# EAGLE design untitled (EAGLE 7.6.0)
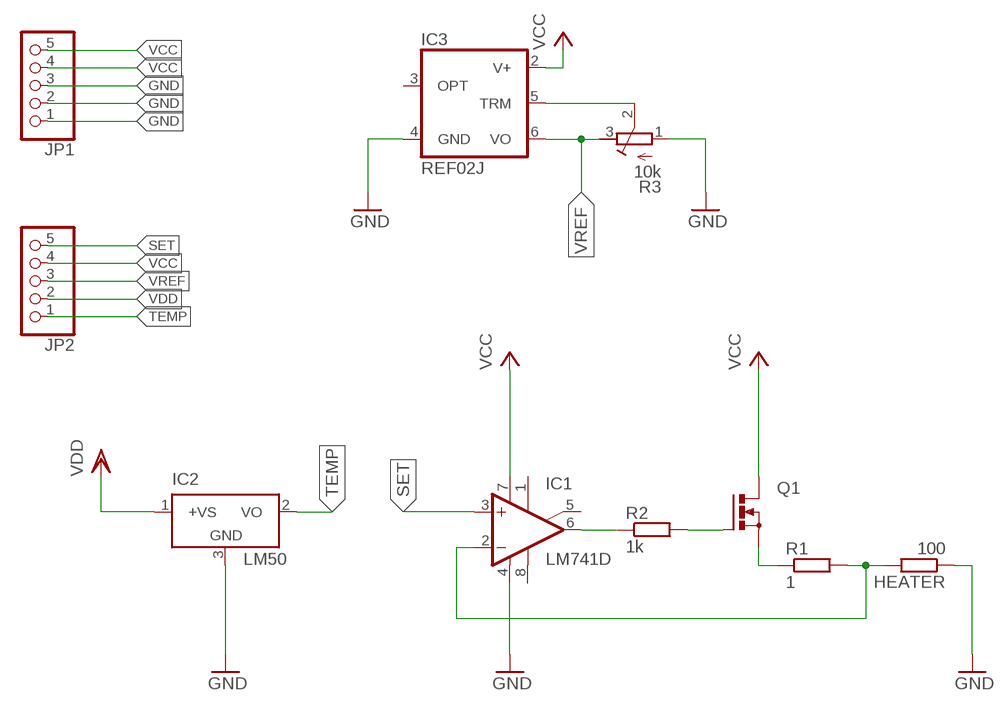
[diagram p0: schematic, sheet 1]

## Parts
HEATER  100  R-EU_WSC0001  [WSC0001]
IC1  LM741D  [SO08]
IC2  LM50  [SOT23]
IC3  REF02J  [TO99]
JP1  PINHD-1X5  [1X05]
JP2  PINHD-1X5  [1X05]
Q1  N-MOSFET-SO8S  [SO-08]
R1  1  R-EU_R1206  [R1206]
R2  1k  R-EU_R1206  [R1206]
R3  10k  R-TRIMM3103  [RTRIM3103]

## Nets
GND: HEATER.1 IC1.4(V-) IC2.3(GND) IC3.4(GND) JP1.1 JP1.2 JP1.3 R3.1(A)
N$1: IC1.6(OUT) R2.1
N$2: Q1.4(G) R2.2
N$3: HEATER.2 IC1.2(-IN) R1.2
N$4: Q1.1(S) Q1.2(S) Q1.3(S) R1.1
N$6: IC3.5(TRM) R3.2(S)
SET: IC1.3(+IN) JP2.5
TEMP: IC2.2(VO) JP2.1
VCC: IC1.7(V+) IC3.2(V+) JP1.4 JP1.5 JP2.4 Q1.5(D) Q1.6(D) Q1.7(D) Q1.8(D)
VDD: IC2.1(+VS) JP2.2
VREF: IC3.6(VO) JP2.3 R3.3(E)
Unconnected: IC1.1(ON1) IC1.5(ON2) IC1.8(OPT) IC3.3(OPT)

## Library data of the parts
HEATER R1 R2 = rcl:R-EU_: RESISTOR, European symbol
IC1 = linear:*741: OP AMP
IC2 = linear:LM50: SOT-23 Single-Supply Centigrade Temperature Sensor Vout = (10mV/°C x Temp °C) +5mmmV Source: http://cache.national.com/ds/LM/LM50.pdf
IC3 = linear:REF02: VOLTAGE REFERENCE
JP1 JP2 = pinhead:PINHD-1X5: PIN HEADER
Q1 = transistor-power:N-MOSFET-SO8: N-Channel MOSFET Example: FDS7760A; N-Channel Logic Level PowerTrench® MOSFET FDS2572; N-Channel UltraFET® Trench MOSFET Source: www.fairchildsemi.com
R3 = rcl:R-TRIMM: Trimm resistor

## Board
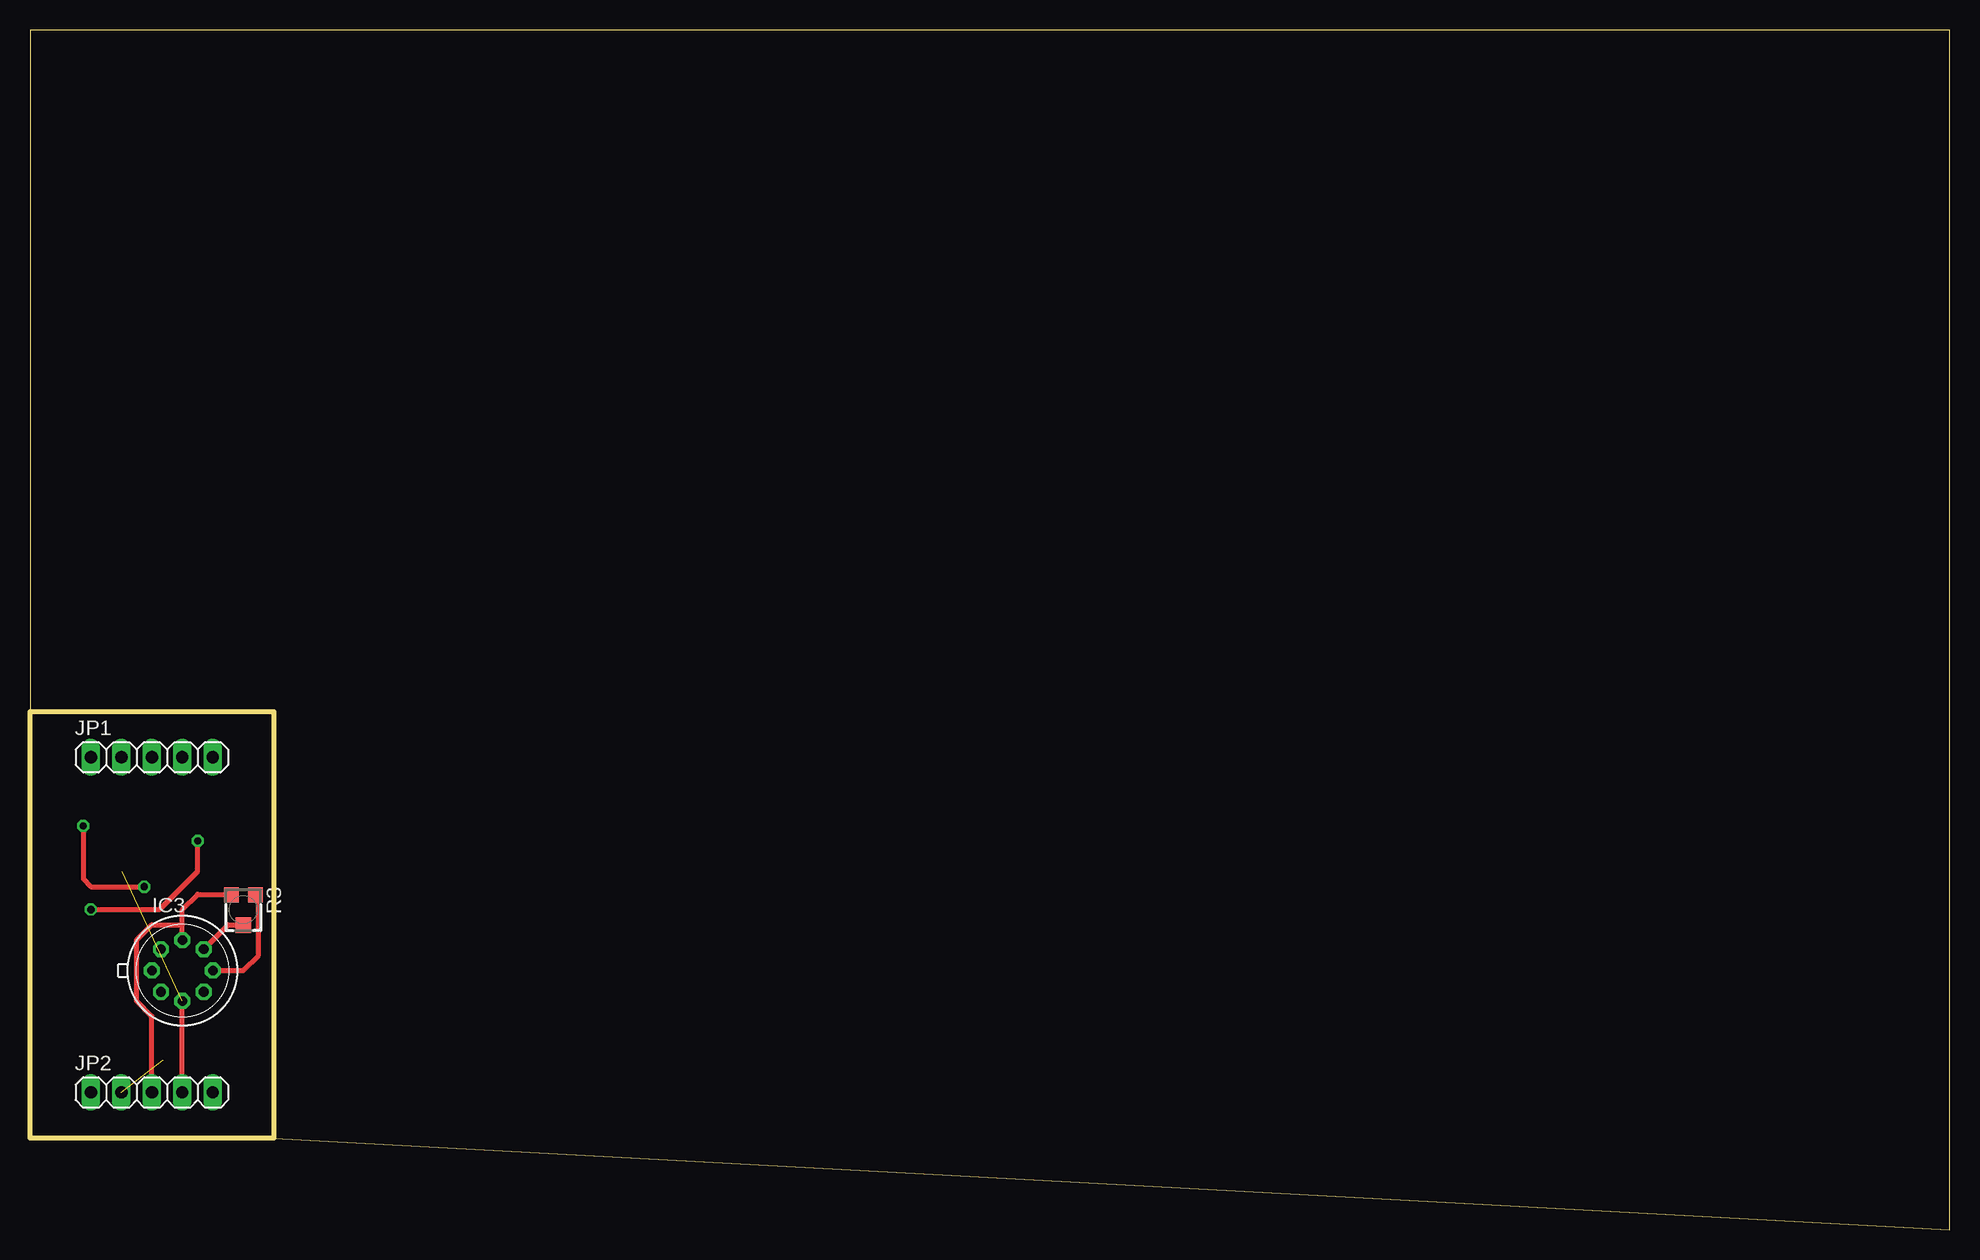
[diagram p1: board, top side]
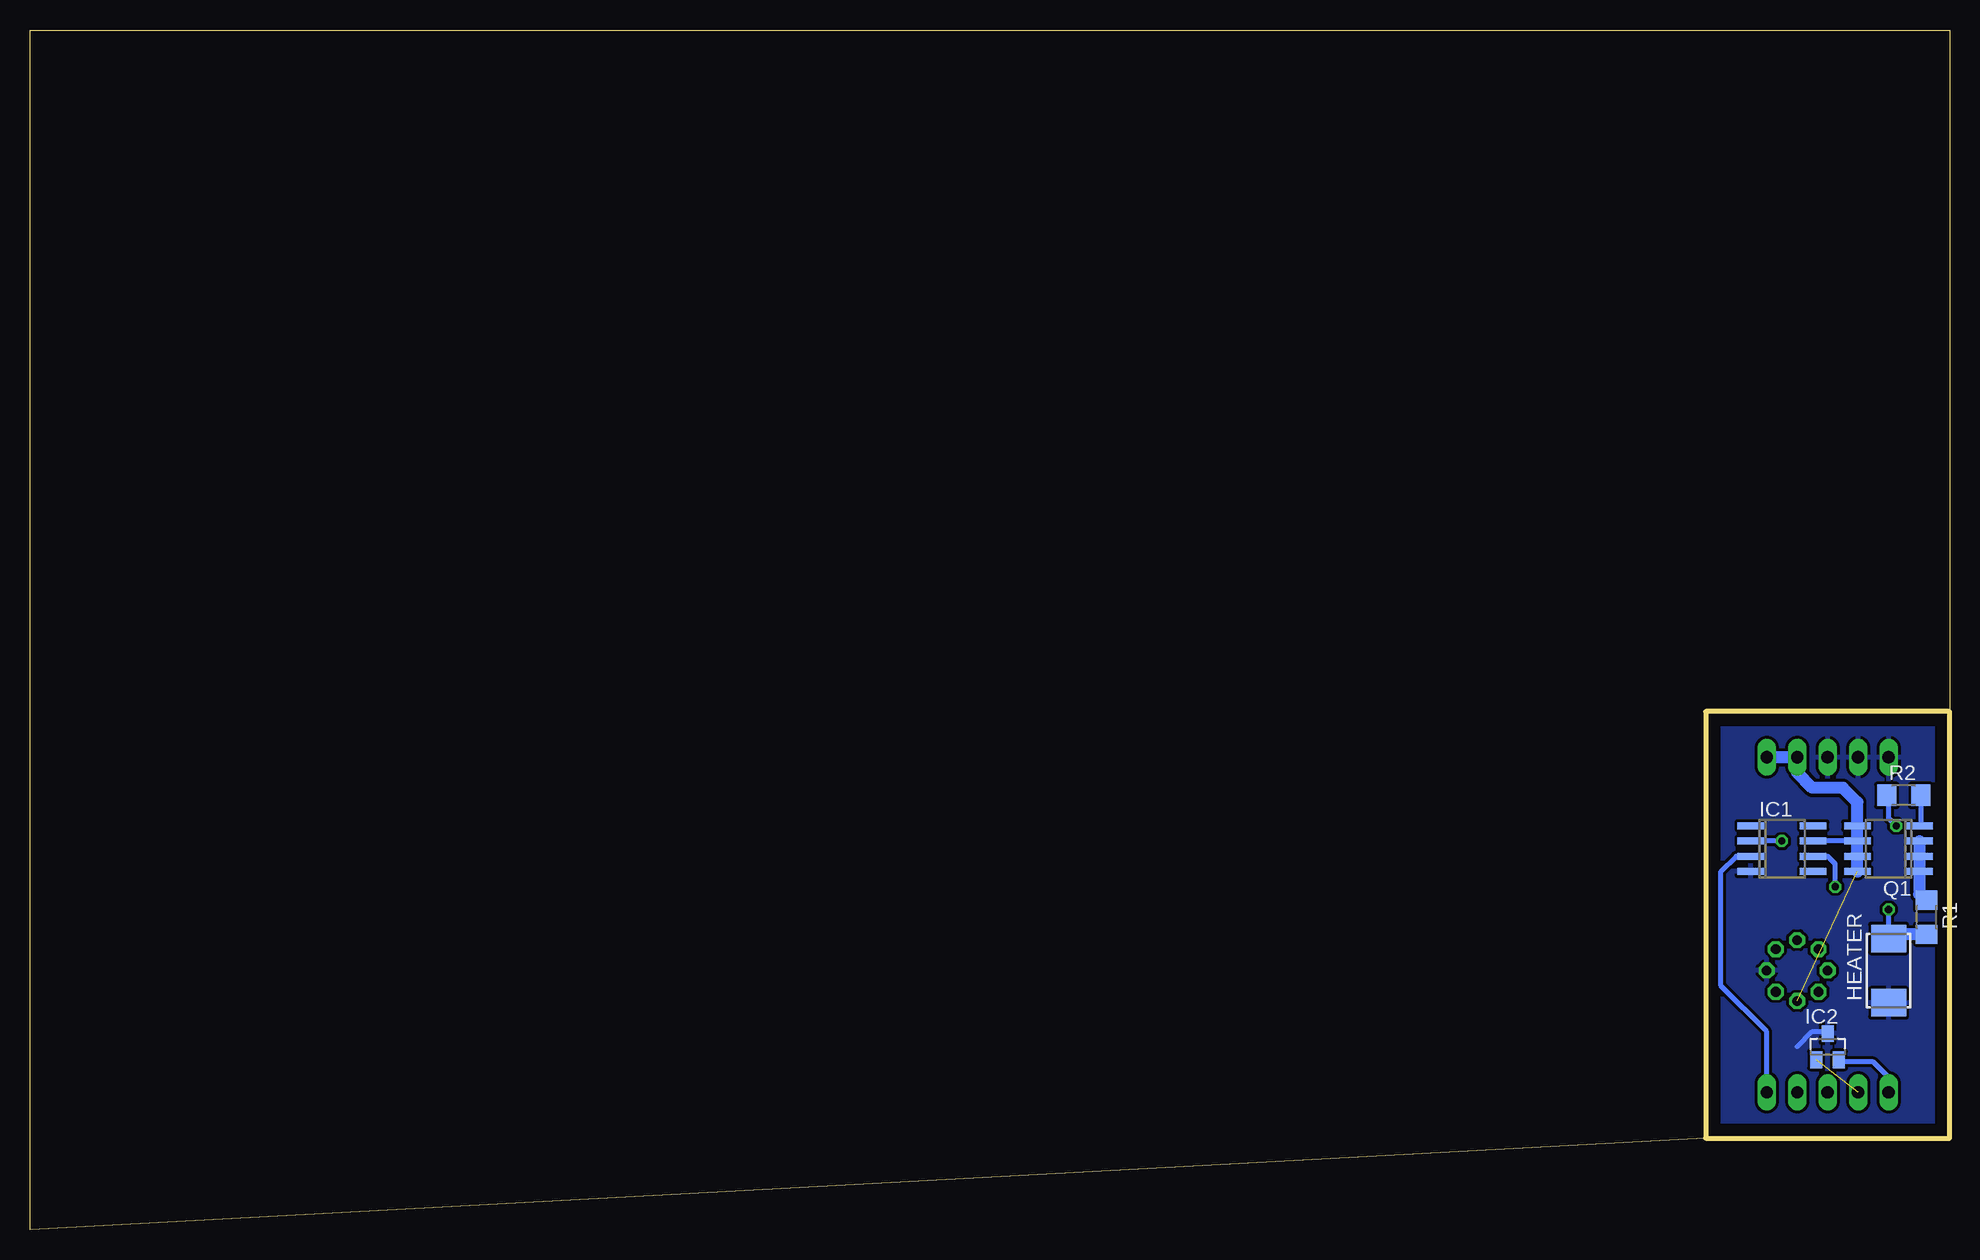
[diagram p2: board, bottom side, seen from below]

Size 160 x 100 mm. Coordinates in mm from the lower left corner, seen from the top.
Outline: 20.32,7.62 160,0 160,100 0,100 0,43.18
Outline: 0,43.18 0,7.62 20.32,7.62
Outline: 0,43.18 20.32,43.18 20.32,7.62
Copper layers (1*16): Top 0.035mm / dielectric 1.5mm / Bottom 0.035mm
Design rules "default": minimum track width 10mil, minimum drill 24mil, track to track 8mil, track to pad 8mil, pad to pad 8mil, via to via 8mil, smd to smd 8mil, copper to edge 40mil, drill to drill 8mil, minimum pad ring 10mil, minimum via ring 8mil, stop-mask expansion 4mil, vias tented up to drill 0mil, thermal gap 10mil

### Footprints (pad centres in the part's own frame; a part is rotated, then mirrored left to right if it is on the bottom)
WSC0001 = smd 2.29 x 2.92: 1 -2.675,0; 2 2.675,0
SO08 = smd 0.6 x 2.2: 1 -1.905,-2.6; 2 -0.635,-2.6; 3 0.635,-2.6; 4 1.905,-2.6; 5 1.905,2.6; 6 0.635,2.6; 7 -0.635,2.6; 8 -1.905,2.6
SOT23 = smd 1 x 1.4: 1 -0.95,-1.1; 2 0.95,-1.1; 3 0,1.1
TO99 = drill 0.813 octagon: 1 -1.778,-1.778; 2 0,-2.54; 3 1.778,-1.778; 4 2.54,0; 5 1.778,1.778; 6 0,2.54; 7 -1.778,1.778; 8 -2.54,0
1X05 = drill 1.016 long: 1 -5.08,0; 2 -2.54,0; 3 0,0; 4 2.54,0; 5 5.08,0
SO-08 = smd 0.6 x 2.2: 1 -1.905,-2.6; 2 -0.635,-2.6; 3 0.635,-2.6; 4 1.905,-2.6; 5 1.905,2.6; 6 0.635,2.6; 7 -0.635,2.6; 8 -1.905,2.6
R1206 = smd 1.6 x 1.803: 1 -1.422,0; 2 1.422,0
RTRIM3103 = smd 1.2 x 1.25: 1 -1,-1.225; 3 1,-1.225 | smd 1.3 x 1.3: 2 0,1.3

### Placement (x,y rotation side)
HEATER  5.08,21.59 90 bottom
IC1  13.97,31.75 270 bottom
IC2  10.16,15.24 0 bottom
IC3  12.7,21.59 0 top
JP1  10.16,39.37 0 top
JP2  10.16,11.43 0 top
Q1  5.08,31.75 90 bottom
R1  1.91,26.04 270 bottom
R2  3.81,36.2 0 bottom
R3  17.78,26.67 180 top

### Tracks (layer width: path | path; a pad name or v marks a point on that pad's centre or on a via)
GND
  Top 0.406: IC3.4 17.78,21.59 19.05,22.86 19.05,27.62 R3.1
  Bottom 0.406: 12.7,15.24 11.43,16.51 10.33,16.51 IC2.3
  pour Bottom (isolate 0.254): 0,43.18 20.32,43.18 20.32,7.62 0,7.62
N$1  (via drill 0.6)
  Top 0.406: v4.45,33.66 4.45,29.21 5.08,28.57 v9.53,28.57
  Bottom 0.406: v4.45,33.66 5.08,34.29 5.08,36.04 R2.1 | v9.53,28.57 9.53,30.48 10.16,31.11 IC1.6
N$2
  Bottom 0.406: R2.2 2.39,33.75 Q1.4
N$3  (via drill 0.6)
  Top 0.406: v5.08,26.67 10.79,26.67 13.97,29.84 v13.97,32.38
  Bottom 0.406: HEATER.2 v5.08,26.67 | v13.97,32.38 IC1.2
  Bottom 1.016: R1.2 4.73,24.61 HEATER.2
N$4
  Bottom 1.016: Q1.3 Q1.2 Q1.1 2.54,29.84 2.54,27.94 2.06,27.46 R1.1
N$6
  Top 0.406: IC3.5 16.51,25.4 17.75,25.4 R3.2
SET
  Bottom 0.406: JP2.5 15.24,16.51 19.05,20.32 19.05,29.84 17.78,31.11 IC1.3
TEMP
  Bottom 0.406: JP2.1 5.08,12.7 6.35,13.97 9.04,13.97 IC2.2
VCC  (1 unrouted)
  Top 0.406: JP2.4 IC3.2
  Bottom 0.406: Q1.6 IC1.7
  Bottom 1.016: Q1.8 Q1.7 Q1.6 | Q1.6 Q1.5 | Q1.6 7.68,35.62 8.89,36.83 11.43,36.83 12.7,38.1 JP1.4 JP1.5
VDD  (1 unrouted)
VREF
  Top 0.406: IC3.6 12.7,25.4 | 12.7,25.4 12.7,26.67 13.97,27.94 16.73,27.94 R3.3 | JP2.3 10.16,17.78 8.89,19.05 8.89,24.13 10.16,25.4 12.7,25.4